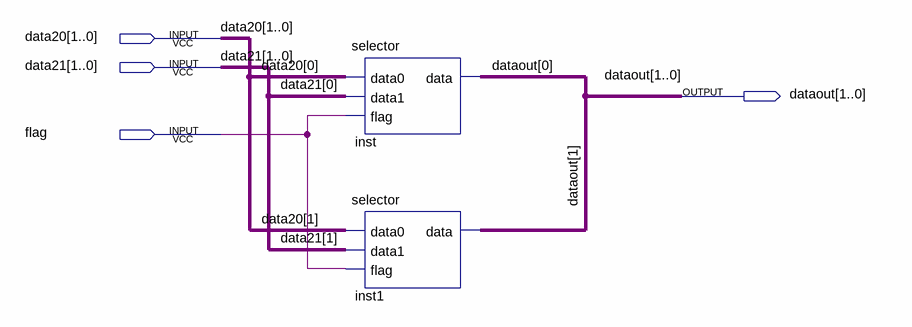
[diagram p0: schematic sheet]
// Quartus schematic selector2.bdf as structural Verilog: 2 symbols, 4 pins
module selector2 (
  input  [1:0] data20,
  input  [1:0] data21,
  input  flag,
  output [1:0] dataout
);

  selector inst (.data0(data20[0]), .data1(data21[0]), .flag(flag), .data(dataout[0]));
  selector inst1 (.data0(data20[1]), .data1(data21[1]), .flag(flag), .data(dataout[1]));
endmodule
